# Altium schematic sheet Digital_Interface.SchDoc
size A3; CompanyName: Technische Hochschule Nürnberg Georg Simon Ohm; Organization: UltraZohm; Address1: Kesslerplatz 12; Address2: 90489 Nürnberg; Address3: GERMANY; SheetNumber: 21; Website: www.ultrazohm.com
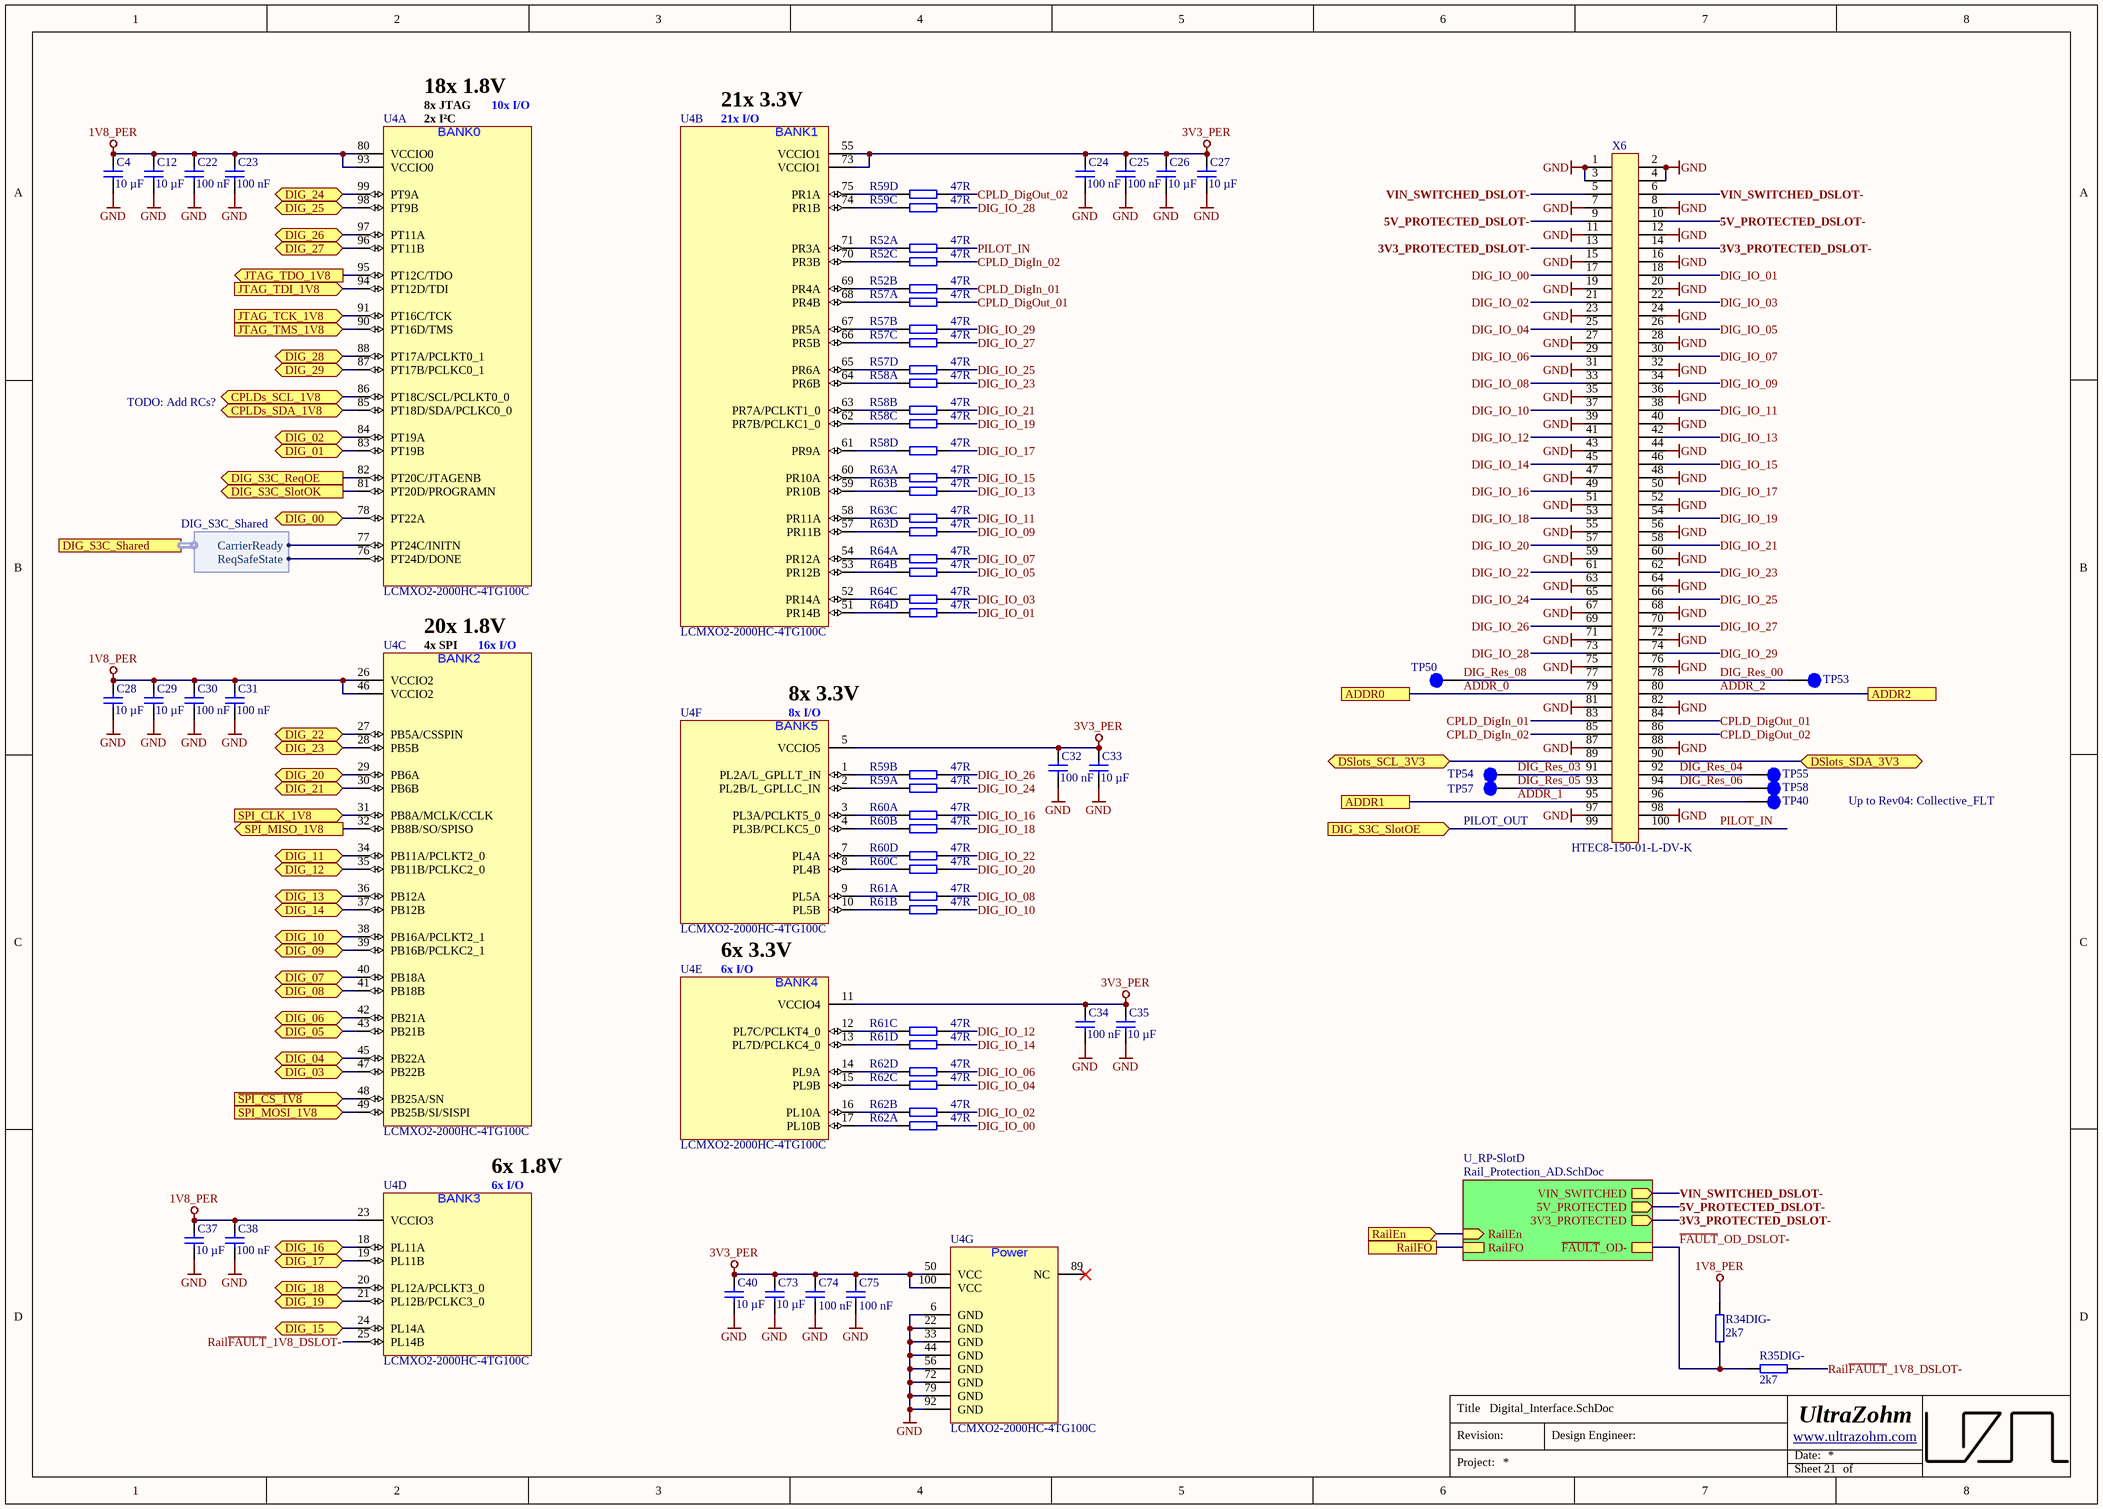
[diagram p0: Digital_Interface.SchDoc]

## Parts
C4  10 µF  [C_0603_TE]
C12  10 µF  [C_0603_TE]
C22  100 nF  [C_0603_TE]
C23  100 nF  [C_0603_TE]
C24  100 nF  [C_0603_TE]
C25  100 nF  [C_0603_TE]
C26  10 µF  [C_0603_TE]
C27  10 µF  [C_0603_TE]
C28  10 µF  [C_0603_TE]
C29  10 µF  [C_0603_TE]
C30  100 nF  [C_0603_TE]
C31  100 nF  [C_0603_TE]
C32  100 nF  [C_0603_TE]
C33  10 µF  [C_0603_TE]
C34  100 nF  [C_0603_TE]
C35  10 µF  [C_0603_TE]
C37  10 µF  [C_0603_TE]
C38  100 nF  [C_0603_TE]
C40  10 µF  [C_0603_TE]
C73  10 µF  [C_0603_TE]
C74  100 nF  [C_0603_TE]
C75  100 nF  [C_0603_TE]
R34DIG-  2k7  [R_0603_TE]
R35DIG-  2k7  [R_0603_TE]
R52  47R  [RESCAV80P160X320X70-8N]  (parts A,B,C of 4)
R57  47R  [RESCAV80P160X320X70-8N]  (parts A,B,C,D of 4)
R58  47R  [RESCAV80P160X320X70-8N]  (parts A,B,C,D of 4)
R59  47R  [RESCAV80P160X320X70-8N]  (parts A,B,C,D of 4)
R60  47R  [RESCAV80P160X320X70-8N]  (parts A,B,C,D of 4)
R61  47R  [RESCAV80P160X320X70-8N]  (parts A,B,C,D of 4)
R62  47R  [RESCAV80P160X320X70-8N]  (parts A,B,C,D of 4)
R63  47R  [RESCAV80P160X320X70-8N]  (parts A,B,C,D of 4)
R64  47R  [RESCAV80P160X320X70-8N]  (parts A,B,C,D of 4)
TP40  Testpoint 1mm  [TP_1mm]  (value not drawn)  (no BOM)
TP50  Testpoint 1mm  [TP_1mm]  (value not drawn)  (no BOM)
TP53  Testpoint 1mm  [TP_1mm]  (value not drawn)  (no BOM)
TP54  Testpoint 1mm  [TP_1mm]  (value not drawn)  (no BOM)
TP55  Testpoint 1mm  [TP_1mm]  (value not drawn)  (no BOM)
TP57  Testpoint 1mm  [TP_1mm]  (value not drawn)  (no BOM)
TP58  Testpoint 1mm  [TP_1mm]  (value not drawn)  (no BOM)
U4  LCMXO2-2000HC-4TG100C  [QFP50P1600X1600X160-100N]  (parts A,B,C,D,E,F,G of 7)
X6  HTEC8-150-01-L-DV-K  [HTEC8-150-XX-X-DV]

## Sub-sheets
U_RP-SlotD = Rail_Protection_AD.SchDoc: RailEn (in), VIN_SWITCHED (out), ~{FAULT}_OD-, 5V_PROTECTED (out), 3V3_PROTECTED (out), RailFO

## Ports
ADDR0, ADDR1, ADDR2, CPLDs_SCL_1V8 (bidir), CPLDs_SDA_1V8 (bidir), DIG_00 (bidir), DIG_01 (bidir), DIG_02 (bidir), DIG_03 (bidir), DIG_04 (bidir), DIG_05 (bidir), DIG_06 (bidir), DIG_07 (bidir), DIG_08 (bidir), DIG_09 (bidir), DIG_10 (bidir), DIG_11 (bidir), DIG_12 (bidir), DIG_13 (bidir), DIG_14 (bidir), DIG_15 (bidir), DIG_16 (bidir), DIG_17 (bidir), DIG_18 (bidir), DIG_19 (bidir), DIG_20 (bidir), DIG_21 (bidir), DIG_22 (bidir), DIG_23 (bidir), DIG_24 (bidir), DIG_25 (bidir), DIG_26 (bidir), DIG_27 (bidir), DIG_28 (bidir), DIG_29 (bidir), DIG_S3C_ReqOE (out), DIG_S3C_Shared (harness DIG_S3C_Shared), DIG_S3C_SlotOE (in), DIG_S3C_SlotOK (out), DSlots_SCL_3V3 (bidir), DSlots_SDA_3V3 (bidir), JTAG_TCK_1V8 (in), JTAG_TDI_1V8 (in), JTAG_TDO_1V8 (out), JTAG_TMS_1V8 (in), RailEn (in), RailFO, SPI_CLK_1V8 (in), SPI_MISO_1V8 (out), SPI_MOSI_1V8 (in), ~{SPI_CS_1V8} (in)

## Harnesses
DIG_S3C_Shared: CarrierReady, ReqSafeState

## Nets
1V8_PER: C4.1 C12.1 C22.2 C23.2 C28.1 C29.1 C30.2 C31.2 C37.1 C38.2 R34DIG-.2 U4.23(VCCIO3) U4.26(VCCIO2) U4.46(VCCIO2) U4.80(VCCIO0) U4.93(VCCIO0)
3V3_PER: C24.2 C25.2 C26.1 C27.1 C32.2 C33.1 C34.2 C35.1 C40.1 C73.1 C74.2 C75.2 U4.5(VCCIO5) U4.11(VCCIO4) U4.50(VCC) U4.55(VCCIO1) U4.73(VCCIO1) U4.100(VCC)
GND: C4.2 C12.2 C22.1 C23.1 C24.1 C25.1 C26.2 C27.2 C28.2 C29.2 C30.1 C31.1 C32.1 C33.2 C34.1 C35.2 C37.2 C38.1 C40.2 C73.2 C74.1 C75.1 U4.6(GND) U4.22(GND) U4.33(GND) U4.44(GND) U4.56(GND) U4.72(GND) U4.79(GND) U4.92(GND) X6.1 X6.2 X6.3 X6.4 X6.7 X6.8 X6.11 X6.12 X6.15 X6.16 X6.19 X6.20 X6.23 X6.24 X6.27 X6.28 X6.31 X6.32 X6.35 X6.36 X6.39 X6.40 X6.43 X6.44 X6.47 X6.48 X6.51 X6.52 X6.55 X6.56 X6.59 X6.60 X6.63 X6.64 X6.67 X6.68 X6.71 X6.72 X6.75 X6.76 X6.81 X6.82 X6.87 X6.88 X6.97 X6.98
3V3_PROTECTED_DSLOT-: X6.13 X6.14 ; sheet U_RP-SlotD/3V3_PROTECTED
5V_PROTECTED_DSLOT-: X6.9 X6.10 ; sheet U_RP-SlotD/5V_PROTECTED
ADDR_0: X6.79 ; port ADDR0
ADDR_1: X6.95 ; port ADDR1
ADDR_2: X6.80 ; port ADDR2
CPLD_DigIn_01: R52.7 X6.83
CPLD_DigIn_02: R52.6 X6.85
CPLD_DigOut_01: R57.8 X6.84
CPLD_DigOut_02: R59.5 X6.86
CPLDs_SCL_1V8: U4.86(PT18C/SCL/PCLKT0_0) ; port CPLDs_SCL_1V8
CPLDs_SDA_1V8: U4.85(PT18D/SDA/PCLKC0_0) ; port CPLDs_SDA_1V8
DIG_00: U4.78(PT22A) ; port DIG_00
DIG_01: U4.83(PT19B) ; port DIG_01
DIG_02: U4.84(PT19A) ; port DIG_02
DIG_03: U4.47(PB22B) ; port DIG_03
DIG_04: U4.45(PB22A) ; port DIG_04
DIG_05: U4.43(PB21B) ; port DIG_05
DIG_06: U4.42(PB21A) ; port DIG_06
DIG_07: U4.40(PB18A) ; port DIG_07
DIG_08: U4.41(PB18B) ; port DIG_08
DIG_09: U4.39(PB16B/PCLKC2_1) ; port DIG_09
DIG_10: U4.38(PB16A/PCLKT2_1) ; port DIG_10
DIG_11: U4.34(PB11A/PCLKT2_0) ; port DIG_11
DIG_12: U4.35(PB11B/PCLKC2_0) ; port DIG_12
DIG_13: U4.36(PB12A) ; port DIG_13
DIG_14: U4.37(PB12B) ; port DIG_14
DIG_15: U4.24(PL14A) ; port DIG_15
DIG_16: U4.18(PL11A) ; port DIG_16
DIG_17: U4.19(PL11B) ; port DIG_17
DIG_18: U4.20(PL12A/PCLKT3_0) ; port DIG_18
DIG_19: U4.21(PL12B/PCLKC3_0) ; port DIG_19
DIG_20: U4.29(PB6A) ; port DIG_20
DIG_21: U4.30(PB6B) ; port DIG_21
DIG_22: U4.27(PB5A/CSSPIN) ; port DIG_22
DIG_23: U4.28(PB5B) ; port DIG_23
DIG_24: U4.99(PT9A) ; port DIG_24
DIG_25: U4.98(PT9B) ; port DIG_25
DIG_26: U4.97(PT11A) ; port DIG_26
DIG_27: U4.96(PT11B) ; port DIG_27
DIG_28: U4.88(PT17A/PCLKT0_1) ; port DIG_28
DIG_29: U4.87(PT17B/PCLKC0_1) ; port DIG_29
DIG_IO_00: R62.8 X6.17
DIG_IO_01: R64.5 X6.18
DIG_IO_02: R62.7 X6.21
DIG_IO_03: R64.6 X6.22
DIG_IO_04: R62.6 X6.25
DIG_IO_05: R64.7 X6.26
DIG_IO_06: R62.5 X6.29
DIG_IO_07: R64.8 X6.30
DIG_IO_08: R61.8 X6.33
DIG_IO_09: R63.5 X6.34
DIG_IO_10: R61.7 X6.37
DIG_IO_11: R63.6 X6.38
DIG_IO_12: R61.6 X6.41
DIG_IO_13: R63.7 X6.42
DIG_IO_14: R61.5 X6.45
DIG_IO_15: R63.8 X6.46
DIG_IO_16: R60.8 X6.49
DIG_IO_17: R58.5 X6.50
DIG_IO_18: R60.7 X6.53
DIG_IO_19: R58.6 X6.54
DIG_IO_20: R60.6 X6.57
DIG_IO_21: R58.7 X6.58
DIG_IO_22: R60.5 X6.61
DIG_IO_23: R58.8 X6.62
DIG_IO_24: R59.8 X6.65
DIG_IO_25: R57.5 X6.66
DIG_IO_26: R59.7 X6.69
DIG_IO_27: R57.6 X6.70
DIG_IO_28: R59.6 X6.73
DIG_IO_29: R57.7 X6.74
DIG_Res_00: TP53.1 X6.78
DIG_Res_03: TP54.1 X6.91
DIG_Res_04: TP55.1 X6.92
DIG_Res_05: TP57.1 X6.93
DIG_Res_06: TP58.1 X6.94
DIG_Res_08: TP50.1 X6.77
DIG_S3C_ReqOE: U4.82(PT20C/JTAGENB) ; port DIG_S3C_ReqOE
DIG_S3C_SlotOE: X6.99 ; port DIG_S3C_SlotOE
DIG_S3C_SlotOK: U4.81(PT20D/PROGRAMN) ; port DIG_S3C_SlotOK
DSlots_SCL_3V3: X6.89 ; port DSlots_SCL_3V3
DSlots_SDA_3V3: X6.90 ; port DSlots_SDA_3V3
~{FAULT}_OD_DSLOT-: R34DIG-.1 R35DIG-.1 ; sheet U_RP-SlotD/~{FAULT}_OD-
JTAG_TCK_1V8: U4.91(PT16C/TCK) ; port JTAG_TCK_1V8
JTAG_TDI_1V8: U4.94(PT12D/TDI) ; port JTAG_TDI_1V8
JTAG_TDO_1V8: U4.95(PT12C/TDO) ; port JTAG_TDO_1V8
JTAG_TMS_1V8: U4.90(PT16D/TMS) ; port JTAG_TMS_1V8
PILOT_IN: R52.8 X6.100
RailEn: port RailEn, sheet U_RP-SlotD/RailEn
Rail~{FAULT}_1V8_DSLOT-: R35DIG-.2 U4.25(PL14B)
RailFO: port RailFO, sheet U_RP-SlotD/RailFO
~{SPI_CS_1V8}: U4.48(PB25A/SN) ; port ~{SPI_CS_1V8}
SPI_CLK_1V8: U4.31(PB8A/MCLK/CCLK) ; port SPI_CLK_1V8
SPI_MISO_1V8: U4.32(PB8B/SO/SPISO) ; port SPI_MISO_1V8
SPI_MOSI_1V8: U4.49(PB25B/SI/SISPI) ; port SPI_MOSI_1V8
VIN_SWITCHED_DSLOT-: X6.5 X6.6 ; sheet U_RP-SlotD/VIN_SWITCHED
NetR52_1: R52.1 U4.71(PR3A)
NetR52_2: R52.2 U4.69(PR4A)
NetR52_3: R52.3 U4.70(PR3B)
NetR57_1: R57.1 U4.68(PR4B)
NetR57_2: R57.2 U4.67(PR5A)
NetR57_3: R57.3 U4.66(PR5B)
NetR57_4: R57.4 U4.65(PR6A)
NetR58_1: R58.1 U4.64(PR6B)
NetR58_2: R58.2 U4.63(PR7A/PCLKT1_0)
NetR58_3: R58.3 U4.62(PR7B/PCLKC1_0)
NetR58_4: R58.4 U4.61(PR9A)
NetR59_1: R59.1 U4.2(PL2B/L_GPLLC_IN)
NetR59_2: R59.2 U4.1(PL2A/L_GPLLT_IN)
NetR59_3: R59.3 U4.74(PR1B)
NetR59_4: R59.4 U4.75(PR1A)
NetR60_1: R60.1 U4.3(PL3A/PCLKT5_0)
NetR60_2: R60.2 U4.4(PL3B/PCLKC5_0)
NetR60_3: R60.3 U4.8(PL4B)
NetR60_4: R60.4 U4.7(PL4A)
NetR61_1: R61.1 U4.9(PL5A)
NetR61_2: R61.2 U4.10(PL5B)
NetR61_3: R61.3 U4.12(PL7C/PCLKT4_0)
NetR61_4: R61.4 U4.13(PL7D/PCLKC4_0)
NetR62_1: R62.1 U4.17(PL10B)
NetR62_2: R62.2 U4.16(PL10A)
NetR62_3: R62.3 U4.15(PL9B)
NetR62_4: R62.4 U4.14(PL9A)
NetR63_1: R63.1 U4.60(PR10A)
NetR63_2: R63.2 U4.59(PR10B)
NetR63_3: R63.3 U4.58(PR11A)
NetR63_4: R63.4 U4.57(PR11B)
NetR64_1: R64.1 U4.54(PR12A)
NetR64_2: R64.2 U4.53(PR12B)
NetR64_3: R64.3 U4.52(PR14A)
NetR64_4: R64.4 U4.51(PR14B)
NetTP40_1: TP40.1 X6.96
NetU4_76: U4.76(PT24D/DONE) ; port DIG_S3C_Shared.ReqSafeState
NetU4_77: U4.77(PT24C/INITN) ; port DIG_S3C_Shared.CarrierReady

Not connected (* = marked no-connect by the designer): U4 89(NC)*

## Notes on the sheet
- 18x 1.8V
- 8x JTAG
- 10x I/O
- (near U4) 21x 3.3V
- (near U4) 2x I²C
- 21x I/O
- TODO: Add RCs?
- 20x 1.8V
- (near U4) 4x SPI
- 16x I/O
- 8x 3.3V
- (near U4) 8x I/O
- PILOT_OUT
- Up to Rev04: Collective_FLT
- (near U4) 6x 3.3V
- 6x I/O
- (near U4) 6x 1.8V
- Title
- Revision:
- Design Engineer:
- Date:
- Project:
- Sheet
- of
- (in symbol LCMXO2-2000HC-4TG100C, part A) BANK0
- (in symbol LCMXO2-2000HC-4TG100C, part B) BANK1
- (in symbol LCMXO2-2000HC-4TG100C, part C) BANK2
- (in symbol LCMXO2-2000HC-4TG100C, part D) BANK3
- (in symbol LCMXO2-2000HC-4TG100C, part E) BANK4
- (in symbol LCMXO2-2000HC-4TG100C, part F) BANK5
- (in symbol LCMXO2-2000HC-4TG100C, part G) Power

## Library data of the parts
C4 C12 C26-C29 C33 C35 C37 C40 C73 = UZgen_C_0603_10uF_6.3V_X7R: Generic capacitor; Manufacturer: UZgen; Voltage: 6.3V; Tolerance: 10 %; Created from: UZgenTool; Manufacturer Part Number: UZgen_C_0603_10uF_6.3V_X7R; PartID: 3631; Created On: 02.08.2024 11:17:55; Value: 10 µF; Device Package: 0603; Technology: X7R; Mounting Type: SMD; Last Updated: 02.08.2024 11:17:55
C22-C25 C30-C32 C34 C38 C74 C75 = UZgen_C_0603_100nF_50V_X7R: Generic capacitor; Manufacturer: UZgen; Tolerance: 10 %; Voltage: 50 V; Created from: AGeiger; Value: 100 nF; Technology: X7R; Manufacturer Part Number: UZgen_C_0603_100nF_50V_X7R; PartID: 1; Created On: 02/07/2024 14:42:23; Device Package: 0603; Mounting Type: SMD; Last Updated: 02/08/2024 14:45:57
R34DIG- R35DIG- = UZgen_R_0603_2k7: Generic resistor; Manufacturer: UZgen; Tolerance: 1 %; Created from: UZgenTool; Manufacturer Part Number: UZgen_R_0603_2k7; PartID: 231; Created On: 02/07/2024 17:29:49; Value: 2k7; Device Package: 0603; Mounting Type: SMD; Last Updated: 02/07/2024 17:29:49
R52 R57-R64 = CAY16-470J4LF: Resistor Networks & Arrays 47ohm 5% Convex 4resistors; Manufacturer: Bourns; Created from: AGeiger; Manufacturer Part Number: CAY16-470J4LF; PartID: 342; Created On: 06.08.2024 10:26:57; ComponentLink1Description: Datasheet; ComponentLink1URL: https://www.mouser.de/datasheet/2/54/CATCAY-777361.pdf; Component Type: SMD resistor array; Device Package: 1206; Last Updated: 06.08.2024 10:26:57; Mounting Type: SMD; Supplier 1: Mouser; Supplier Part Number 1: 652-CAY16-470J4LF; Supplier 2: LCSC; Supplier Part Number 2: C16081; Type: Resistor Array; Tolerance: 5%; Value: 47R; Live Cycle Status: 1; Stock number: not stored; LCSC Part Number: C16081
TP40 TP50 TP53-TP55 TP57 TP58 = NULL: Manufacturer Part Number: NULL; Created from: AGeiger; Created: 2018_06_25_AGeiger; Value: Testpoint 1mm; PartID: 9; Component Type: Testpoint; Manufacturer: NULL; Supplier 1: NULL; Supplier Part Number 1: NULL; Type: Testpoint; Live Cycle Status: 1
  TP40: Created On: 20/09/2022 13:14:57; Last Updated: 20/09/2022 13:15:39
  TP50 TP53-TP55 TP57 TP58: Created On: 20.09.2022 13:14:57; Last Updated: 20.09.2022 13:15:39
U4 = LCMXO2-2000HC-4TG100C: TQFP-100(14x14) Programmable Logic Device (CPLDs/FPGAs) ROHS; Manufacturer: Lattice; Created from: FRosner; Manufacturer Part Number: LCMXO2-2000HC-4TG100C; PartID: 37; Created On: 03.07.2024 17:33:36; ComponentLink1Description: Datasheet; ComponentLink1URL: https://wmsc.lcsc.com/wmsc/upload/file/pdf/v2/lcsc/2403111456_Lattice-LCMXO2-2000HC-4TG100C_C1521632.pdf; Component Type: CPLD; Device Package: SMD; Last Updated: 03.07.2024 17:33:36; Mounting Type: SMD; Operating Temperature: -0°C - +85°C; Supplier 1: LCSC; Supplier Part Number 1: C1521632; Supplier 2: Mouser; Supplier Part Number 2: 842-XO22000HC4TG100C; Type: CPLD; Live Cycle Status: 1; LCSC Part Number: C1521632; Stock number: not stored
X6 = HTEC8-150-01-L-DV-K: HTEC8-150-01-L-DV-K mating connector for card layout; Manufacturer: SAMTEC; Created from: MGremer; Number of positions: 100; Manufacturer Part Number: HTEC8-150-01-L-DV-K; PartID: 7; Created On: 26.02.2021 16:36:12; ComponentLink1Description: Homepage; ComponentLink1URL: https://www.samtec.com/de/products/htec8-150-01-l-dv; Component Type: Board to Board Connector; Device Package: SMD; Last Updated: 09.07.2024 10:19:13; Mounting Type: SMD; Series: HTEC; Supplier 1: SAMTEC; Supplier Part Number 1: HTEC8-150-01-L-DV-K; Type: Board to Board Connector; Live Cycle Status: 1; LCSC Part Number: C20365621; Stock number: not stored; Number of rows: 2